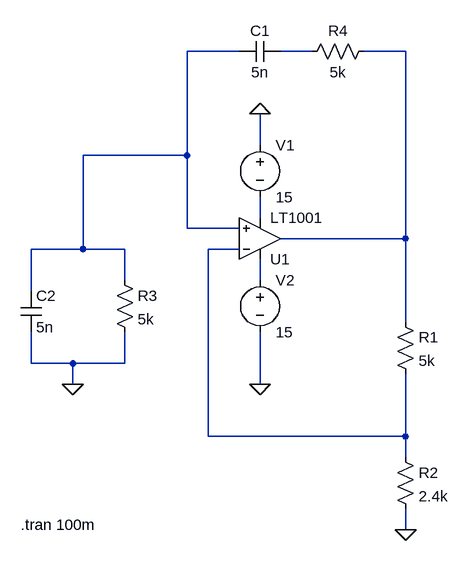
[diagram p0: schematic Q1.asc]
Q1.asc, the LTspice schematic file:
Version 4.1
SHEET 1 888 680
WIRE 336 -320 256 -320
WIRE 448 -320 400 -320
WIRE 592 -320 528 -320
WIRE 368 -176 368 -224
WIRE 256 -160 256 -320
WIRE 256 -160 96 -160
WIRE 368 -64 368 -96
WIRE 256 -48 256 -160
WIRE 336 -48 256 -48
WIRE 592 -32 592 -320
WIRE 592 -32 400 -32
WIRE 96 -16 96 -160
WIRE 96 -16 16 -16
WIRE 160 -16 96 -16
WIRE 336 -16 288 -16
WIRE 160 32 160 -16
WIRE 368 32 368 0
WIRE 16 48 16 -16
WIRE 592 96 592 -32
WIRE 16 160 16 112
WIRE 80 160 16 160
WIRE 160 160 160 112
WIRE 160 160 80 160
WIRE 80 192 80 160
WIRE 368 192 368 112
WIRE 288 272 288 -16
WIRE 592 272 592 176
WIRE 592 272 288 272
WIRE 592 304 592 272
WIRE 592 416 592 384
FLAG 368 -224 0
FLAG 368 192 0
FLAG 592 416 0
FLAG 80 192 0
SYMBOL res 576 80 R0
SYMATTR InstName R1
SYMATTR Value 5k
SYMBOL res 576 288 R0
SYMATTR InstName R2
SYMATTR Value 2.4k
SYMBOL res 144 16 R0
SYMATTR InstName R3
SYMATTR Value 5k
SYMBOL res 544 -336 R90
WINDOW 0 0 56 VBottom 2
WINDOW 3 32 56 VTop 2
SYMATTR InstName R4
SYMATTR Value 5k
SYMBOL cap 400 -336 R90
WINDOW 0 0 32 VBottom 2
WINDOW 3 32 32 VTop 2
SYMATTR InstName C1
SYMATTR Value 5n
SYMBOL cap 0 48 R0
SYMATTR InstName C2
SYMATTR Value 5n
SYMBOL OpAmps\\LT1001 368 32 M180
SYMATTR InstName U1
SYMBOL voltage 368 -192 R0
WINDOW 123 0 0 Left 0
WINDOW 39 0 0 Left 0
SYMATTR InstName V1
SYMATTR Value 15
SYMBOL voltage 368 16 R0
WINDOW 123 0 0 Left 0
WINDOW 39 0 0 Left 0
SYMATTR InstName V2
SYMATTR Value 15
TEXT 0 408 Left 2 !.tran 100m

The netlist it stands for:
* Q1.asc
R1 N003 N005 5k
R2 N005 0 2.4k
R3 N001 0 5k
R4 N003 N002 5k
C1 N002 N001 5n
C2 N001 0 5n
X§U1 N001 N005 N006 N004 N003 LT1001  ; pins In+ In- V+ V- OUT
V1 0 N004 15
V2 N006 0 15
.tran 100m
.lib LTC.lib
.backanno
.end